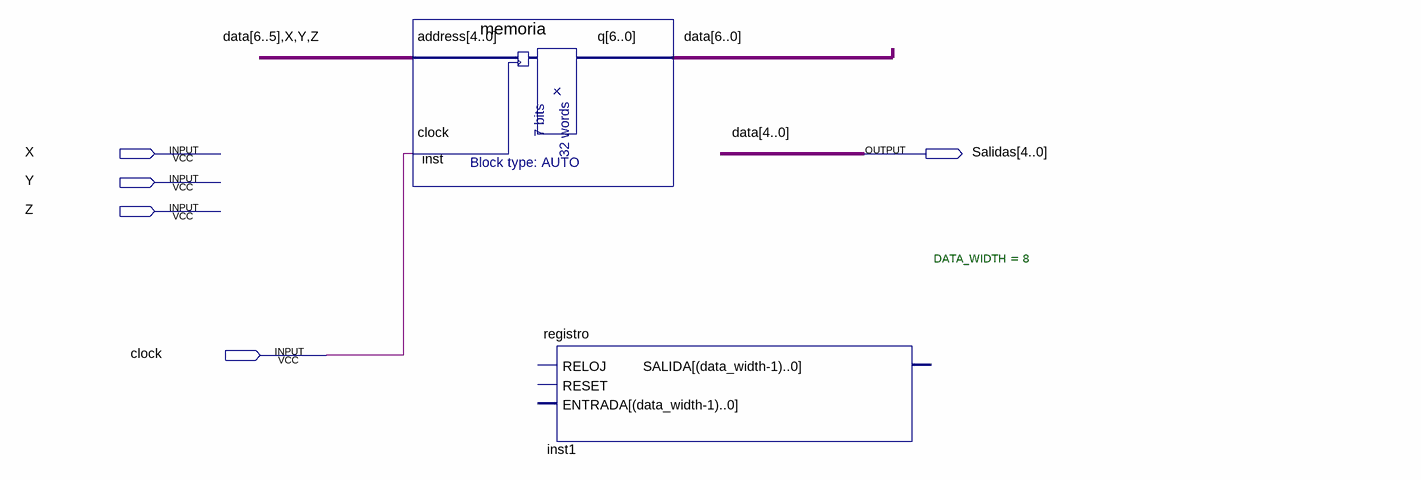
[diagram p0: schematic sheet]
// Quartus schematic trayectoria.bdf as structural Verilog: 2 symbols, 5 pins
module trayectoria (
  input  X,
  input  Y,
  input  Z,
  input  clock,
  output [4:0] Salidas
);

  wire [6:5] data;

  memoria inst (.address({data, X, Y, Z}), .clock(clock), .q({data, Salidas}));
  registro #(.DATA_WIDTH(8)) inst1 ();  // open: RELOJ, RESET, ENTRADA, SALIDA

  // Other names for the same wires on the sheet: data[4:0] = Salidas
endmodule
